# EAGLE schematic InputDevice (EAGLE 7.6.0)
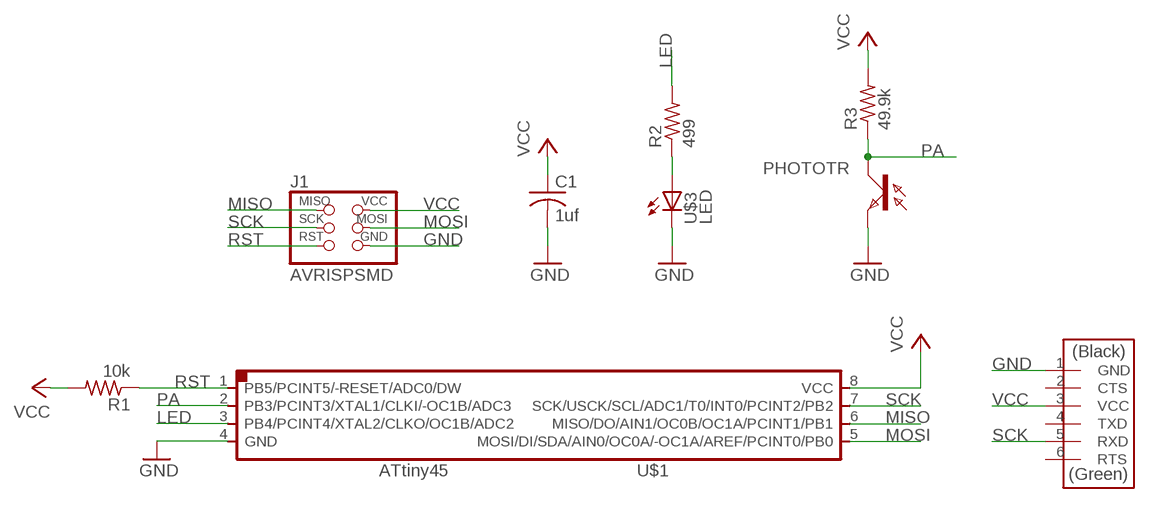
[diagram p0: schematic, sheet 1]

## Parts
C1  1uf  C-USC1206  [C1206]
J1  AVRISPSMD  [2X03SMD]
PHOTOTR  PHOTOTRANSISTOR-NPN1206  [OP1206]
R1  10k  R-US_R1206  [R1206]
R2  499  RESISTOR1206  [1206]
R3  49.9k  RESISTOR1206  [1206]
U$1  ATTINY45SI  [SOIC8]
U$3  LED  LED1206  [1206]
U$4  FTDI-SMD-HEADER  [1X06SMD]

## Nets
GND: C1.2 J1.6(GND) PHOTOTR.EMITTER(E) U$1.4(GND) U$3.2(C) U$4.1(GND)
LED: R2.2 U$1.3(PB4/PCINT4/XTAL2/CLKO/OC1B/ADC2)
MISO: J1.1(MISO) U$1.6(MISO/DO/AIN1/OC0B/OC1A/PCINT1/PB1)
MOSI: J1.4(MOSI) U$1.5(MOSI/DI/SDA/AIN0/OC0A/-OC1A/AREF/PCINT0/PB0)
N$1: R2.1 U$3.1(A)
PA: PHOTOTR.COLLECTOR(C) R3.1 U$1.2(PB3/PCINT3/XTAL1/CLKI/-OC1B/ADC3)
RST: J1.5(RST) R1.1 U$1.1(PB5/PCINT5/-RESET/ADC0/DW)
SCK: J1.3(SCK) U$1.7(SCK/USCK/SCL/ADC1/T0/INT0/PCINT2/PB2) U$4.5(RXD)
VCC: C1.1 J1.2(VCC) R1.2 R3.2 U$1.8(VCC) U$4.3(VCC)
Unconnected: U$4.2(CTS) U$4.4(TXD) U$4.6(RTS)

## Library data of the parts
C1 = rcl:C-US: CAPACITOR, American symbol
J1 = fab:AVRISP
PHOTOTR = 01_fab:PHOTOTRANSISTOR-NPN
R1 = resistor:R-US_: RESISTOR, American symbol
R2 R3 = ng:RESISTOR
U$1 = fab:ATTINY45
U$3 = ng:LED
U$4 = fab:FTDI-SMD-HEADER